# Altium schematic sheet 电源.SchDoc
size A4
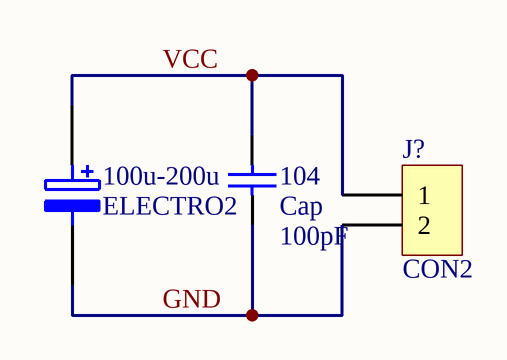
[diagram p0: 电源.SchDoc]

## Parts
100u-200u  ELECTRO2
104  Cap  value 100pF  [RAD-0.3]
J?  CON2

## Nets
GND: 100u-200u.2 104.1 J?.2
VCC: 100u-200u.1 104.2 J?.1

## Library data of the parts
100u-200u = ELECTRO2: Electrolytic Capacitor
104 = Cap: Capacitor; Published: 8-Jun-2000; LatestRevisionDate: 17-Jul-2002; LatestRevisionNote: Re-released for DXP Platform.; PackageReference: RAD-0.3; Publisher: Altium Limited
J? = CON2: Connector